# Altium project OLED.PrjPcb
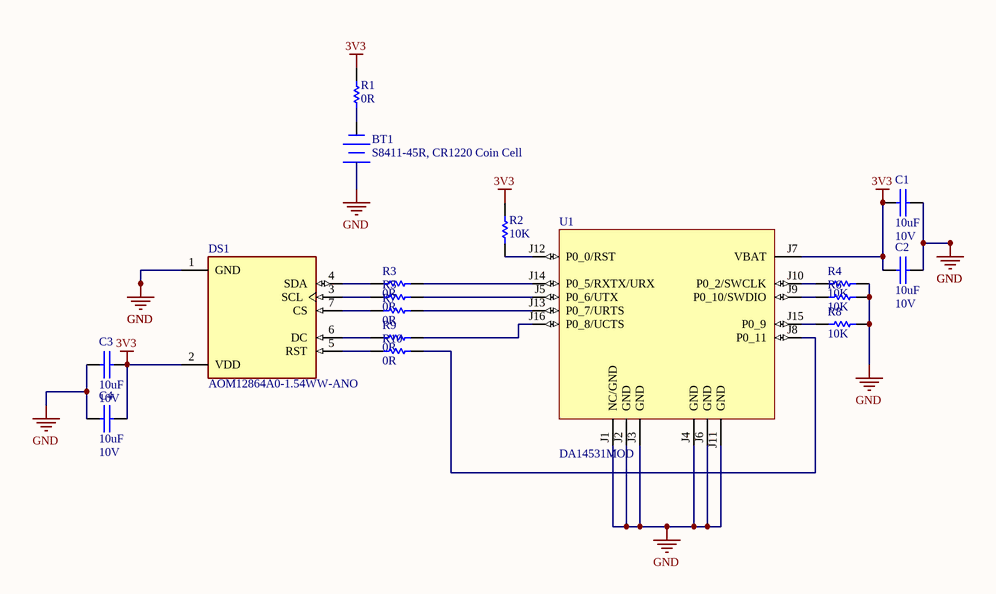
[diagram p0: Schematic.SchDoc]
1 sheet, 17 parts. Net scope: global (net labels, ports and power ports of the same name join across sheets).
Board file: PCB.PcbDoc

## Sheet Schematic.SchDoc
size A4; SheetNumber: 1; SheetTotal: 1

### Parts
BT1  S8411-45R, CR1220 Coin Cell  [HWN_S8411-45R]
C1  10uF  Voltage Rating: 10V  [CAPC1608X10N]
C2  10uF  Voltage Rating: 10V  [CAPC1608X10N]
C3  10uF  Voltage Rating: 10V  [CAPC1608X10N]
C4  10uF  Voltage Rating: 10V  [CAPC1608X10N]
DS1  AOM12864A0-1.54WW-ANO  [LCD_AOM12864A0-1.54WW-ANO]
R1  0R  [RESC1608X06N]
R2  10K  [RESC1608X06N]
R3  0R  [RESC1608X06N]
R4  10K  [RESC1608X06N]
R5  0R  [RESC1608X06N]
R6  10K  [RESC1608X06N]
R7  0R  [RESC1608X06N]
R8  10K  [RESC1608X06N]
R9  0R  [RESC1608X06N]
R10  0R  [RESC1608X06N]
U1  DA14531MOD  [DLG_DA14531MOD-00F01002]

### Nets
3V3: C1.1 C2.1 C3.2 C4.2 DS1.2(VDD) R1.1 R2.1 U1.J7(VBAT)
GND: BT1.1(+) C1.2 C2.2 C3.1 C4.1 DS1.1(GND) R4.2 R6.2 R8.2 U1.J1(NC/GND) U1.J2(GND) U1.J3(GND) U1.J4(GND) U1.J6(GND) U1.J11(GND)
NetBT1_2: BT1.2(-) R1.2
NetDS1_3: DS1.3(SCL) R5.1
NetDS1_4: DS1.4(SDA) R3.1
NetDS1_5: DS1.5(RST) R10.1
NetDS1_6: DS1.6(DC) R9.1
NetDS1_7: DS1.7(CS) R7.1
NetR2_2: R2.2 U1.J12(P0_0/RST)
NetR3_2: R3.2 U1.J14(P0_5/RXTX/URX)
NetR4_1: R4.1 U1.J10(P0_2/SWCLK)
NetR5_2: R5.2 U1.J5(P0_6/UTX)
NetR6_1: R6.1 U1.J9(P0_10/SWDIO)
NetR7_2: R7.2 U1.J13(P0_7/URTS)
NetR8_1: R8.1 U1.J15(P0_9)
NetR9_2: R9.2 U1.J16(P0_8/UCTS)
NetR10_2: R10.2 U1.J8(P0_11)

### Library data of the parts
BT1 = BT-S8411-45R-SR-HWN: Battery Holder, 12 mm Coin Cell, CR1220 SM; Manufacturer: Harwin; Detailed Description: Battery Holder, 12 mm Coin Cell, CR1220, SM, RoHS; Part: S8411-45R, CR1220 Coin Cell; Type: Battery Holder; Manufacturer's Part #: S8411-45R; Revision: 1; Supplier 1: Digi-Key; Supplier 2: Mouser; Supplier Part Number 1: 952-1745-1-ND; Supplier Part Number 2: 855-S8411-45R
C1-C4 = CI-10uF-10V-X5R-SR-MRT: Capacitor, 10uF, 10V, SM; Manufacturer's Part #: GRM188R61A106KE69D; Manufacturer: Murata; Detailed Description: Capacitor, 10uF, 10V, SM 0603, Multilayer Ceramic, X5R, RoHS; Tolerance: 10%; Part: 10uF; Type: Capacitor; Revision: 1; Supplier 1: Digi-Key; Supplier 2: Mouser; Supplier Part Number 1: 490-10474-1-ND; Supplier Part Number 2: 81-GRM188R61A106KE9D; Package: 0603
DS1 = AOM12864A0-1.54WW-ANO: Non-Touch Graphic LCD Display Module - White OLED SPI 1.54 (39.12mm) 128 x 64; MF: Orient Display; SnapEDA_Link: https://www.snapeda.com/parts/AOM12864A0-1.54WW-ANO/Orient+Display/view-part/?ref=snap; Package: None; Value: *; MP: AOM12864A0-1.54WW-ANO; Check_prices: https://www.snapeda.com/parts/AOM12864A0-1.54WW-ANO/Orient+Display/view-part/?ref=eda
R1 R3 R5 R7 R9 R10 = RP-0-SR-KOA: Resistor, 0 ohms, 1/8W, 1%, SM; Manufacturer's Part #: RK73Z1JTTD; Manufacturer: KOA Speer; Detailed Description: Resistor, 0 ohms, 1/8W, 1%, 100 ppm, SM, 75 WV, 100 OV, Thick Film, 0603, RoHS; Voltage Rating: 75V; Resistance: 0; Part: 0R; Type: Resistor; Revision: 1; Power Rating: 1/8W; Tolerance: 1%; Package: 0603; Supplier 1: Arrow Electronics; Supplier 2: Digi-Key; Supplier 3: Mouser; Supplier Part Number 1: RK73Z1JTTD; Supplier Part Number 2: 2019-RK73Z1JTTDCT-ND; Supplier Part Number 3: 660-RK73Z1JTTD
R2 R4 R6 R8 = RP-10K-SR-KOA: Resistor, 10K ohms, 1/8W, 1%, SM; Manufacturer's Part #: RK73H1JTTD1002F; Manufacturer: KOA Speer; Detailed Description: Resistor, 10K ohms, 1/8W, 1%, 100 ppm, SM, 75 WV, 100 OV, Thick Film, 0603, RoHS; Voltage Rating: 75V; Part: 10K; Type: Resistor; Revision: 1; Power Rating: 1/8W; Tolerance: 1%; Resistance: 10K; Package: 0603; Supplier 1: Digi-Key; Supplier 2: Mouser; Supplier 3: Arrow Electronics; Supplier Part Number 1: 2019-RK73H1JTTD1002FCT-ND; Supplier Part Number 2: 660-RK73H1JTTD1002F; Supplier Part Number 3: RK73H1JTTD1002F
U1 = UD-DA14531MOD-00F01002-SR-DLG: DA14531MOD, Bluetooth Low Energy 5.1 Module, SM; Manufacturer 1: Renesas Electronics; Detailed Description: DA14531MOD, Bluetooth Low Energy 5.1 Module, 128 kB Flash, 144kB ROM, 48kB RAM, 16-SMD Module, SM, RoHS; Manufacturer Part Number 1: DA14531MOD-00F01002; Part: DA14531MOD; Type: BLE 5.1 Module; Revision: 1; Package: 16-SMD Module; Supplier 1: Digi-Key; Supplier 2: Mouser; Supplier Part Number 1: 1695-DA14531MOD-00F01002CT-ND; Supplier Part Number 2: 724-DA14531MODF01002